# EAGLE design UI PCB (EAGLE 9.5.2)

## Sheet 1 of 6: IO EXP 1
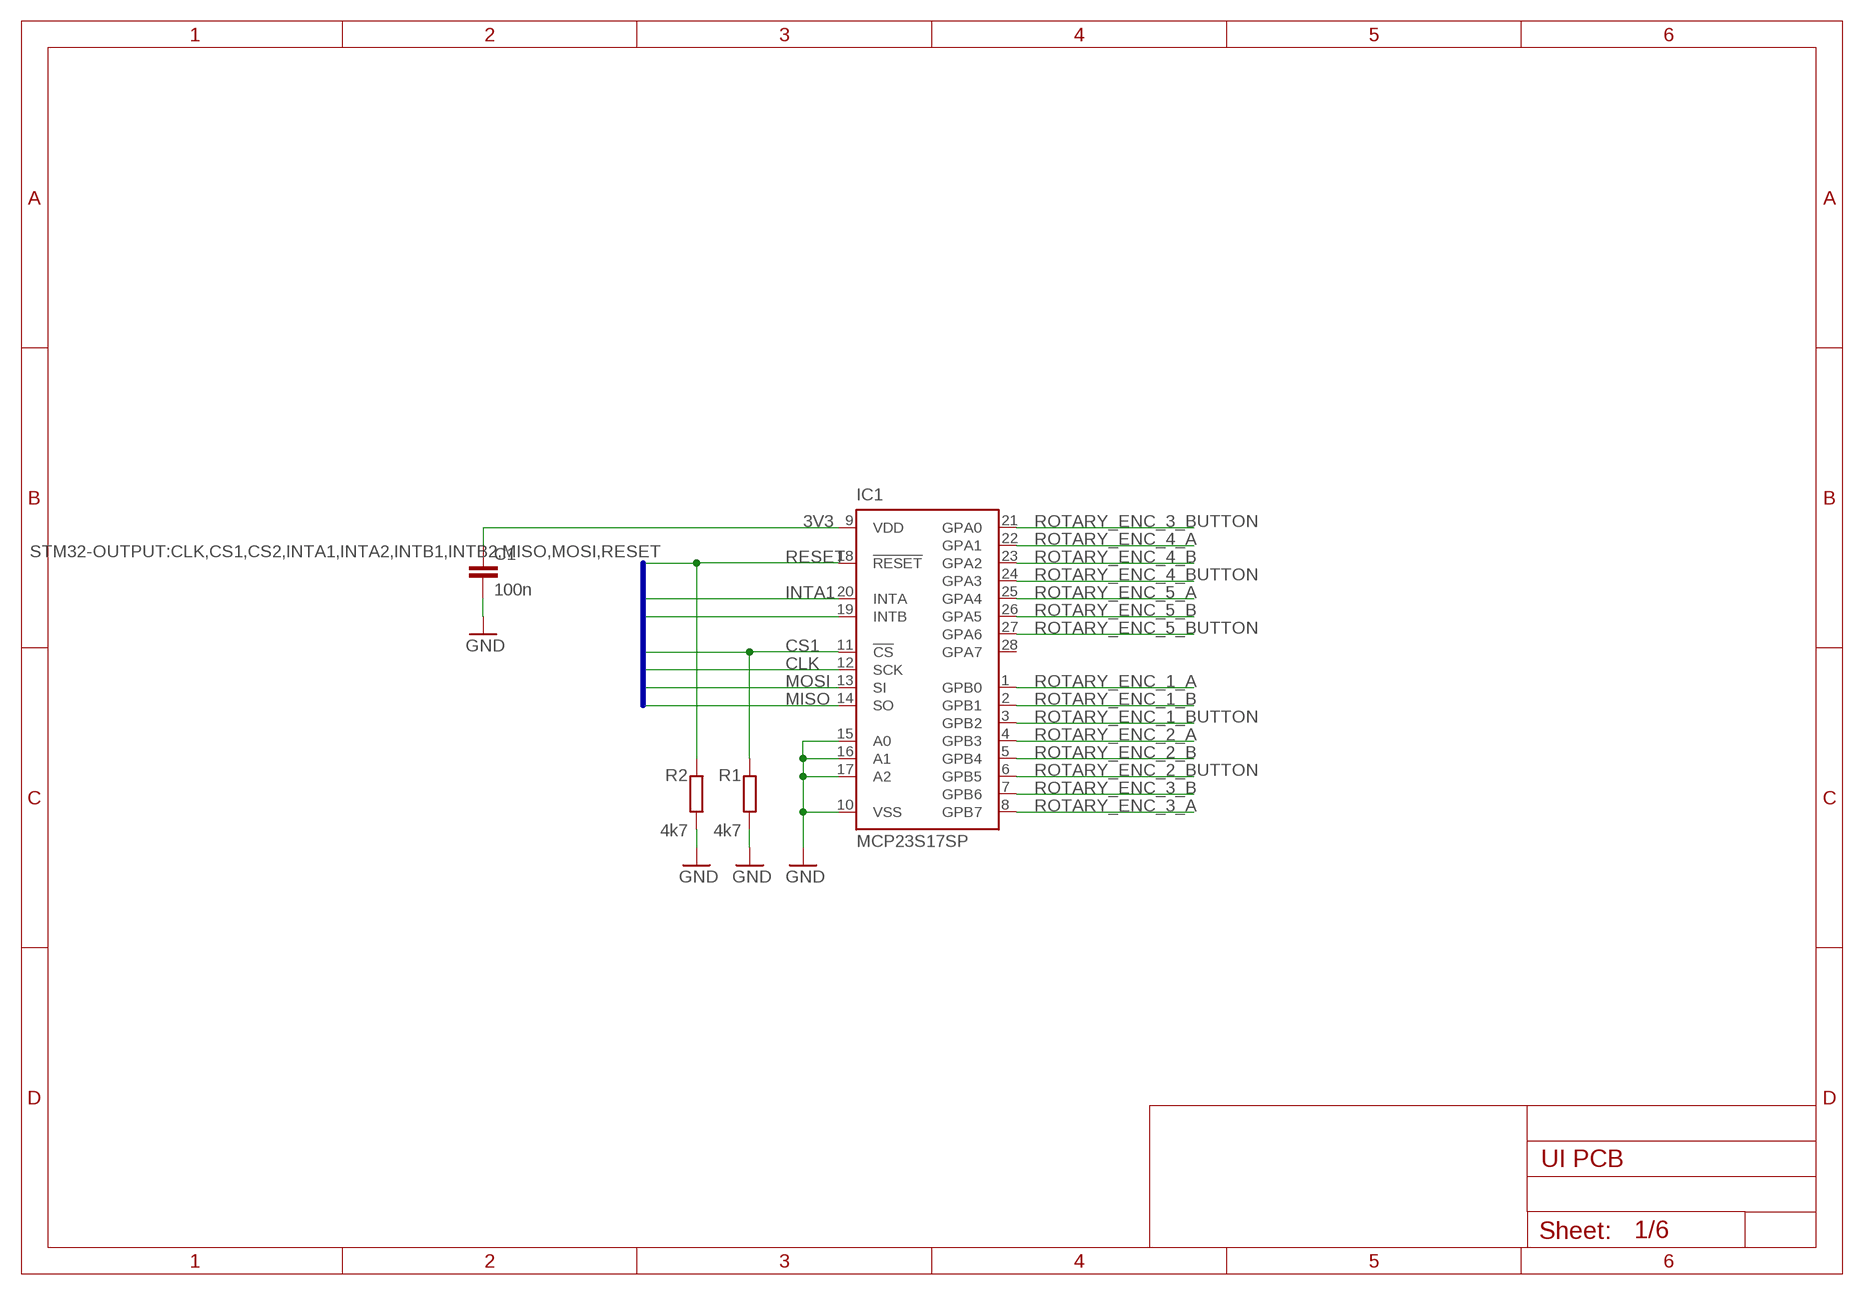
[diagram p0: schematic, sheet 1]

### Parts
C1  100n  C-EUC0603  [C0603]
IC1  MCP23S17SP  [DIL28-3]
R1  4k7  R-EU_R0805  [R0805]
R2  4k7  R-EU_R0805  [R0805]

### Nets
3V3: C1.1 IC1.9(VDD) ; also sheet 2,3,4,5,6
CLK: IC1.12(SCK) ; also sheet 2,5
CS1: IC1.11(!CS) R1.2 ; also sheet 5
GND: C1.2 IC1.10(VSS) IC1.15(A0) IC1.16(A1) IC1.17(A2) R1.1 R2.1 ; also sheet 2,3,4,5,6
INTA1: IC1.20(INTA) ; also sheet 5
INTB1: IC1.19(INTB) ; also sheet 5
MISO: IC1.14(SO) ; also sheet 2,5
MOSI: IC1.13(SI) ; also sheet 2,5
RESET: IC1.18(!RESET) R2.2 ; also sheet 2,5
ROTARY_ENC_1_A: IC1.1(GPB0) ; also sheet 4
ROTARY_ENC_1_B: IC1.2(GPB1) ; also sheet 4
ROTARY_ENC_1_BUTTON: IC1.3(GPB2) ; also sheet 4
ROTARY_ENC_2_A: IC1.4(GPB3) ; also sheet 4
ROTARY_ENC_2_B: IC1.5(GPB4) ; also sheet 4
ROTARY_ENC_2_BUTTON: IC1.6(GPB5) ; also sheet 4
ROTARY_ENC_3_A: IC1.8(GPB7) ; also sheet 4
ROTARY_ENC_3_B: IC1.7(GPB6) ; also sheet 4
ROTARY_ENC_3_BUTTON: IC1.21(GPA0) ; also sheet 4
ROTARY_ENC_4_A: IC1.22(GPA1) ; also sheet 4
ROTARY_ENC_4_B: IC1.23(GPA2) ; also sheet 4
ROTARY_ENC_4_BUTTON: IC1.24(GPA3) ; also sheet 4
ROTARY_ENC_5_A: IC1.25(GPA4) ; also sheet 4
ROTARY_ENC_5_B: IC1.26(GPA5) ; also sheet 4
ROTARY_ENC_5_BUTTON: IC1.27(GPA6) ; also sheet 4
Unconnected: IC1.28(GPA7)

### Buses
STM32-OUTPUT:CLK,CS1,CS2,INTA1,INTA2,INTB1,INTB2,MISO,MOSI,RESET

## Sheet 2 of 6: IO EXP 2
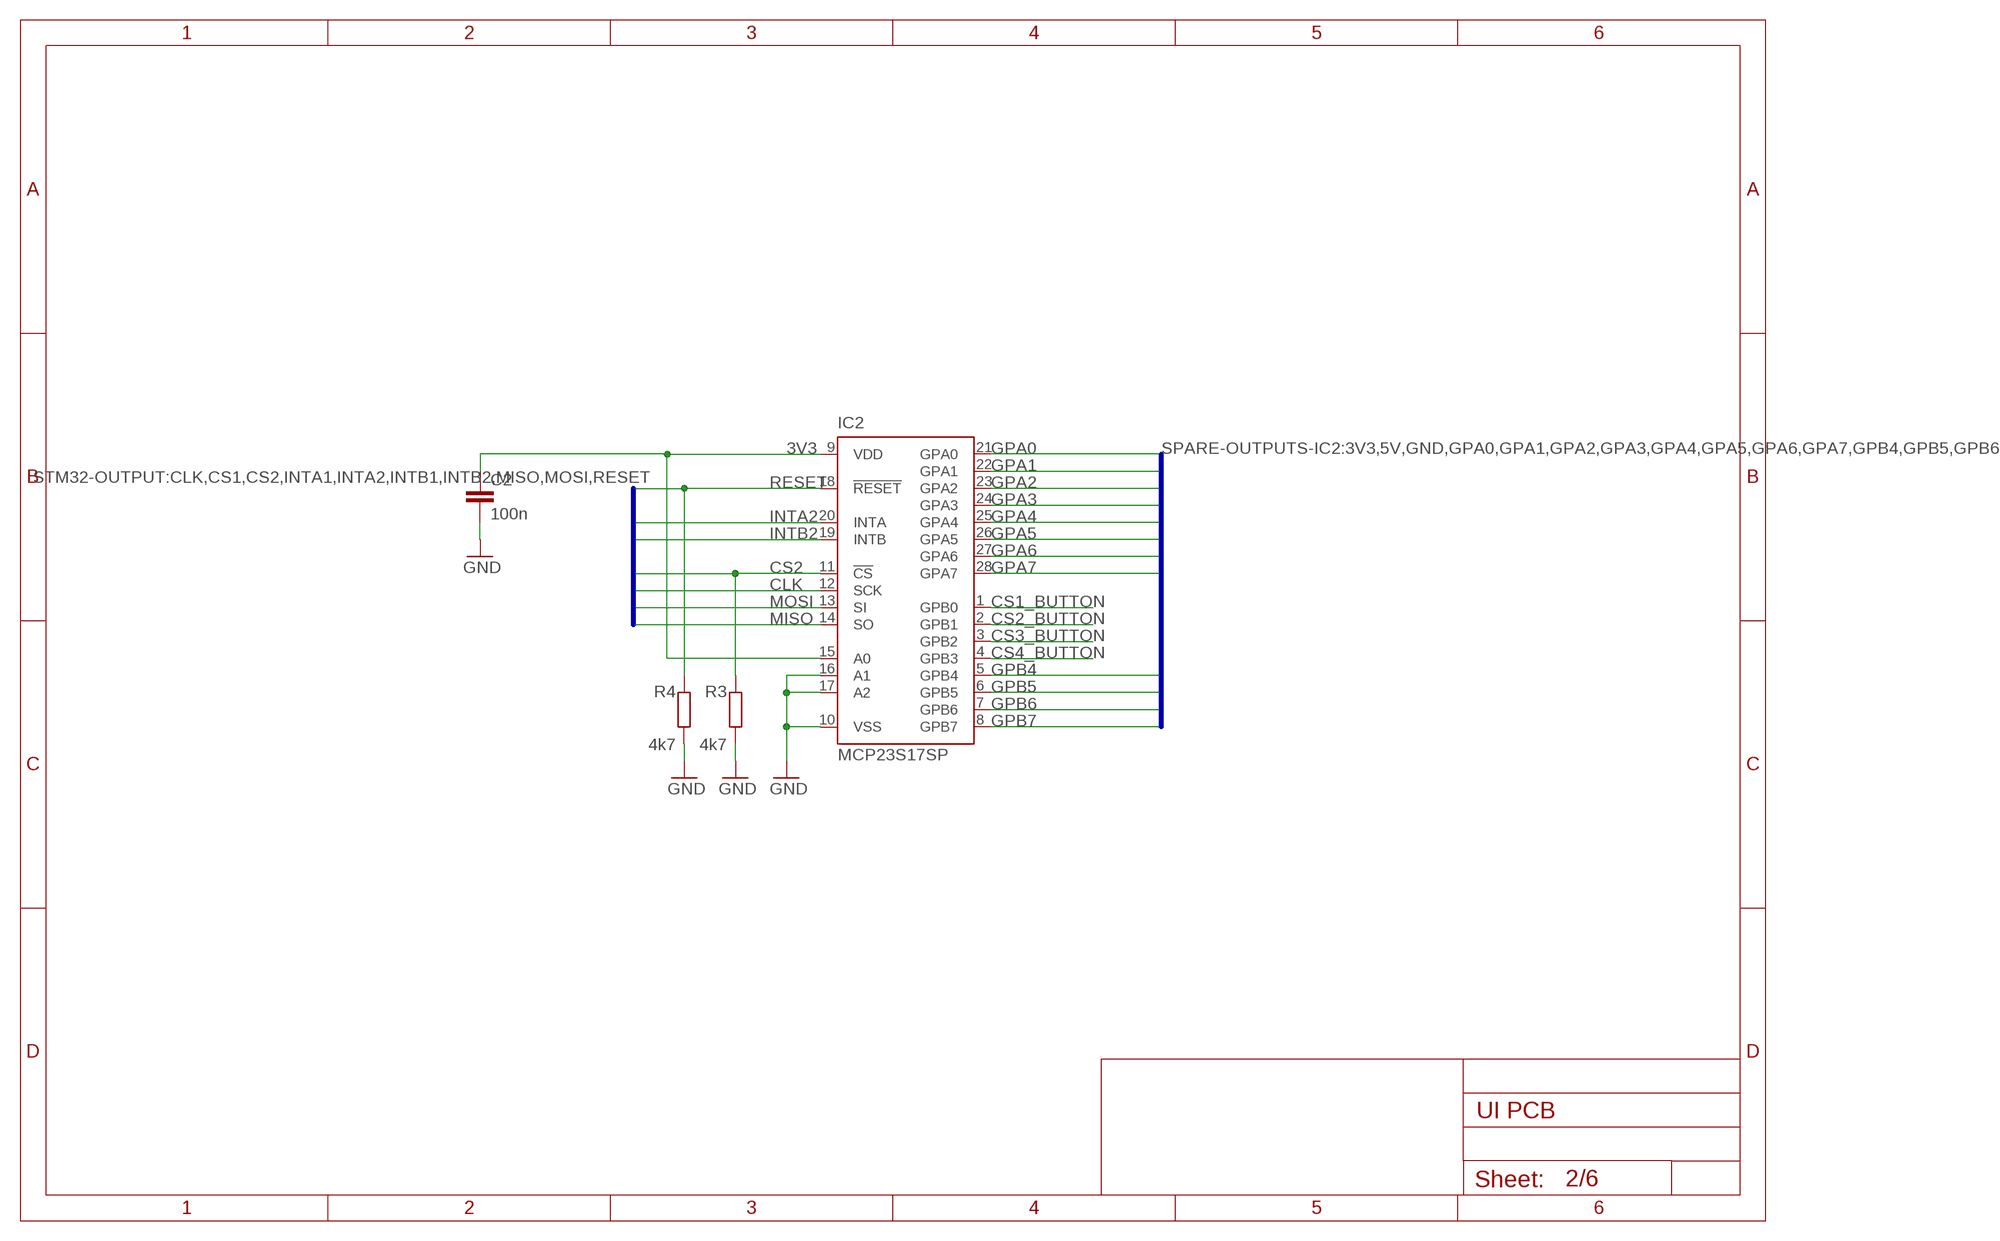
[diagram p1: schematic, sheet 2]

### Parts
C2  100n  C-EUC0603  [C0603]
IC2  MCP23S17SP  [DIL28-3]
R3  4k7  R-EU_R0805  [R0805]
R4  4k7  R-EU_R0805  [R0805]

### Nets
3V3: C2.1 IC2.9(VDD) IC2.15(A0) ; also sheet 1,3,4,5,6
CLK: IC2.12(SCK) ; also sheet 1,5
CS1_BUTTON: IC2.1(GPB0) ; also sheet 3
CS2: IC2.11(!CS) R3.2 ; also sheet 5
CS2_BUTTON: IC2.2(GPB1) ; also sheet 3
CS3_BUTTON: IC2.3(GPB2) ; also sheet 3
CS4_BUTTON: IC2.4(GPB3) ; also sheet 3
GND: C2.2 IC2.10(VSS) IC2.16(A1) IC2.17(A2) R3.1 R4.1 ; also sheet 1,3,4,5,6
GPA0: IC2.21(GPA0) ; also sheet 6
GPA1: IC2.22(GPA1) ; also sheet 6
GPA2: IC2.23(GPA2) ; also sheet 6
GPA3: IC2.24(GPA3) ; also sheet 6
GPA4: IC2.25(GPA4) ; also sheet 6
GPA5: IC2.26(GPA5) ; also sheet 6
GPA6: IC2.27(GPA6) ; also sheet 6
GPA7: IC2.28(GPA7) ; also sheet 6
GPB4: IC2.5(GPB4) ; also sheet 6
GPB5: IC2.6(GPB5) ; also sheet 6
GPB6: IC2.7(GPB6) ; also sheet 6
GPB7: IC2.8(GPB7) ; also sheet 6
INTA2: IC2.20(INTA) ; also sheet 5
INTB2: IC2.19(INTB) ; also sheet 5
MISO: IC2.14(SO) ; also sheet 1,5
MOSI: IC2.13(SI) ; also sheet 1,5
RESET: IC2.18(!RESET) R4.2 ; also sheet 1,5

### Buses
SPARE-OUTPUTS-IC2:3V3,5V,GND,GPA0,GPA1,GPA2,GPA3,GPA4,GPA5,GPA6,GPA7,GPB4,GPB5,GPB6,GPB7
STM32-OUTPUT:CLK,CS1,CS2,INTA1,INTA2,INTB1,INTB2,MISO,MOSI,RESET

## Sheet 3 of 6: CS button cons
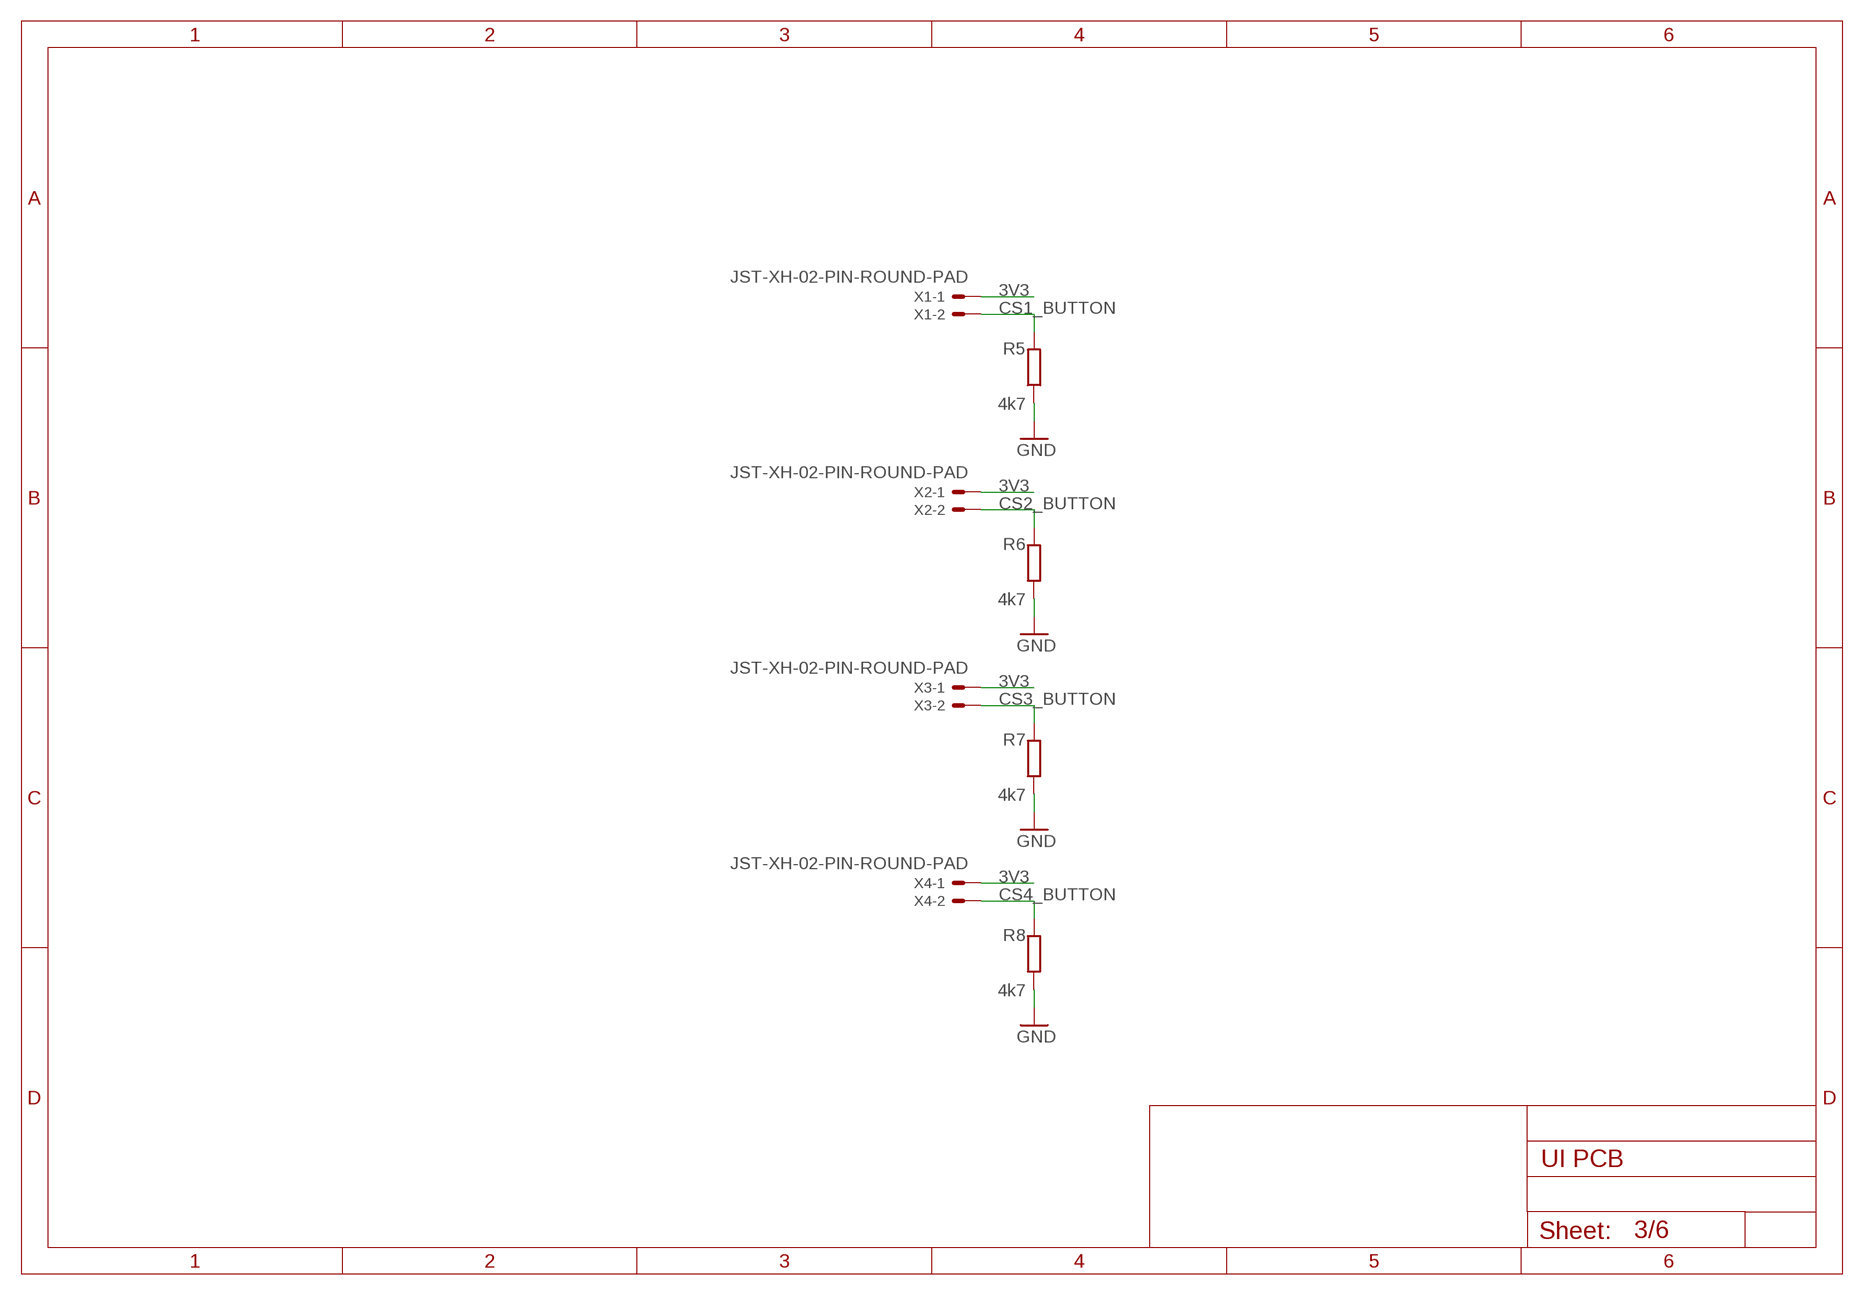
[diagram p2: schematic, sheet 3]

### Parts
R5  4k7  R-EU_R0805  [R0805]
R6  4k7  R-EU_R0805  [R0805]
R7  4k7  R-EU_R0805  [R0805]
R8  4k7  R-EU_R0805  [R0805]
X1  JST-XH-02-PIN-ROUND-PAD  [JST-XH-02-PACKAGE-ROUND-PAD]
X2  JST-XH-02-PIN-ROUND-PAD  [JST-XH-02-PACKAGE-ROUND-PAD]
X3  JST-XH-02-PIN-ROUND-PAD  [JST-XH-02-PACKAGE-ROUND-PAD]
X4  JST-XH-02-PIN-ROUND-PAD  [JST-XH-02-PACKAGE-ROUND-PAD]

### Nets
3V3: X1.1 X2.1 X3.1 X4.1 ; also sheet 1,2,4,5,6
CS1_BUTTON: R5.2 X1.2 ; also sheet 2
CS2_BUTTON: R6.2 X2.2 ; also sheet 2
CS3_BUTTON: R7.2 X3.2 ; also sheet 2
CS4_BUTTON: R8.2 X4.2 ; also sheet 2
GND: R5.1 R6.1 R7.1 R8.1 ; also sheet 1,2,4,5,6

## Sheet 4 of 6: ROT ENC cons
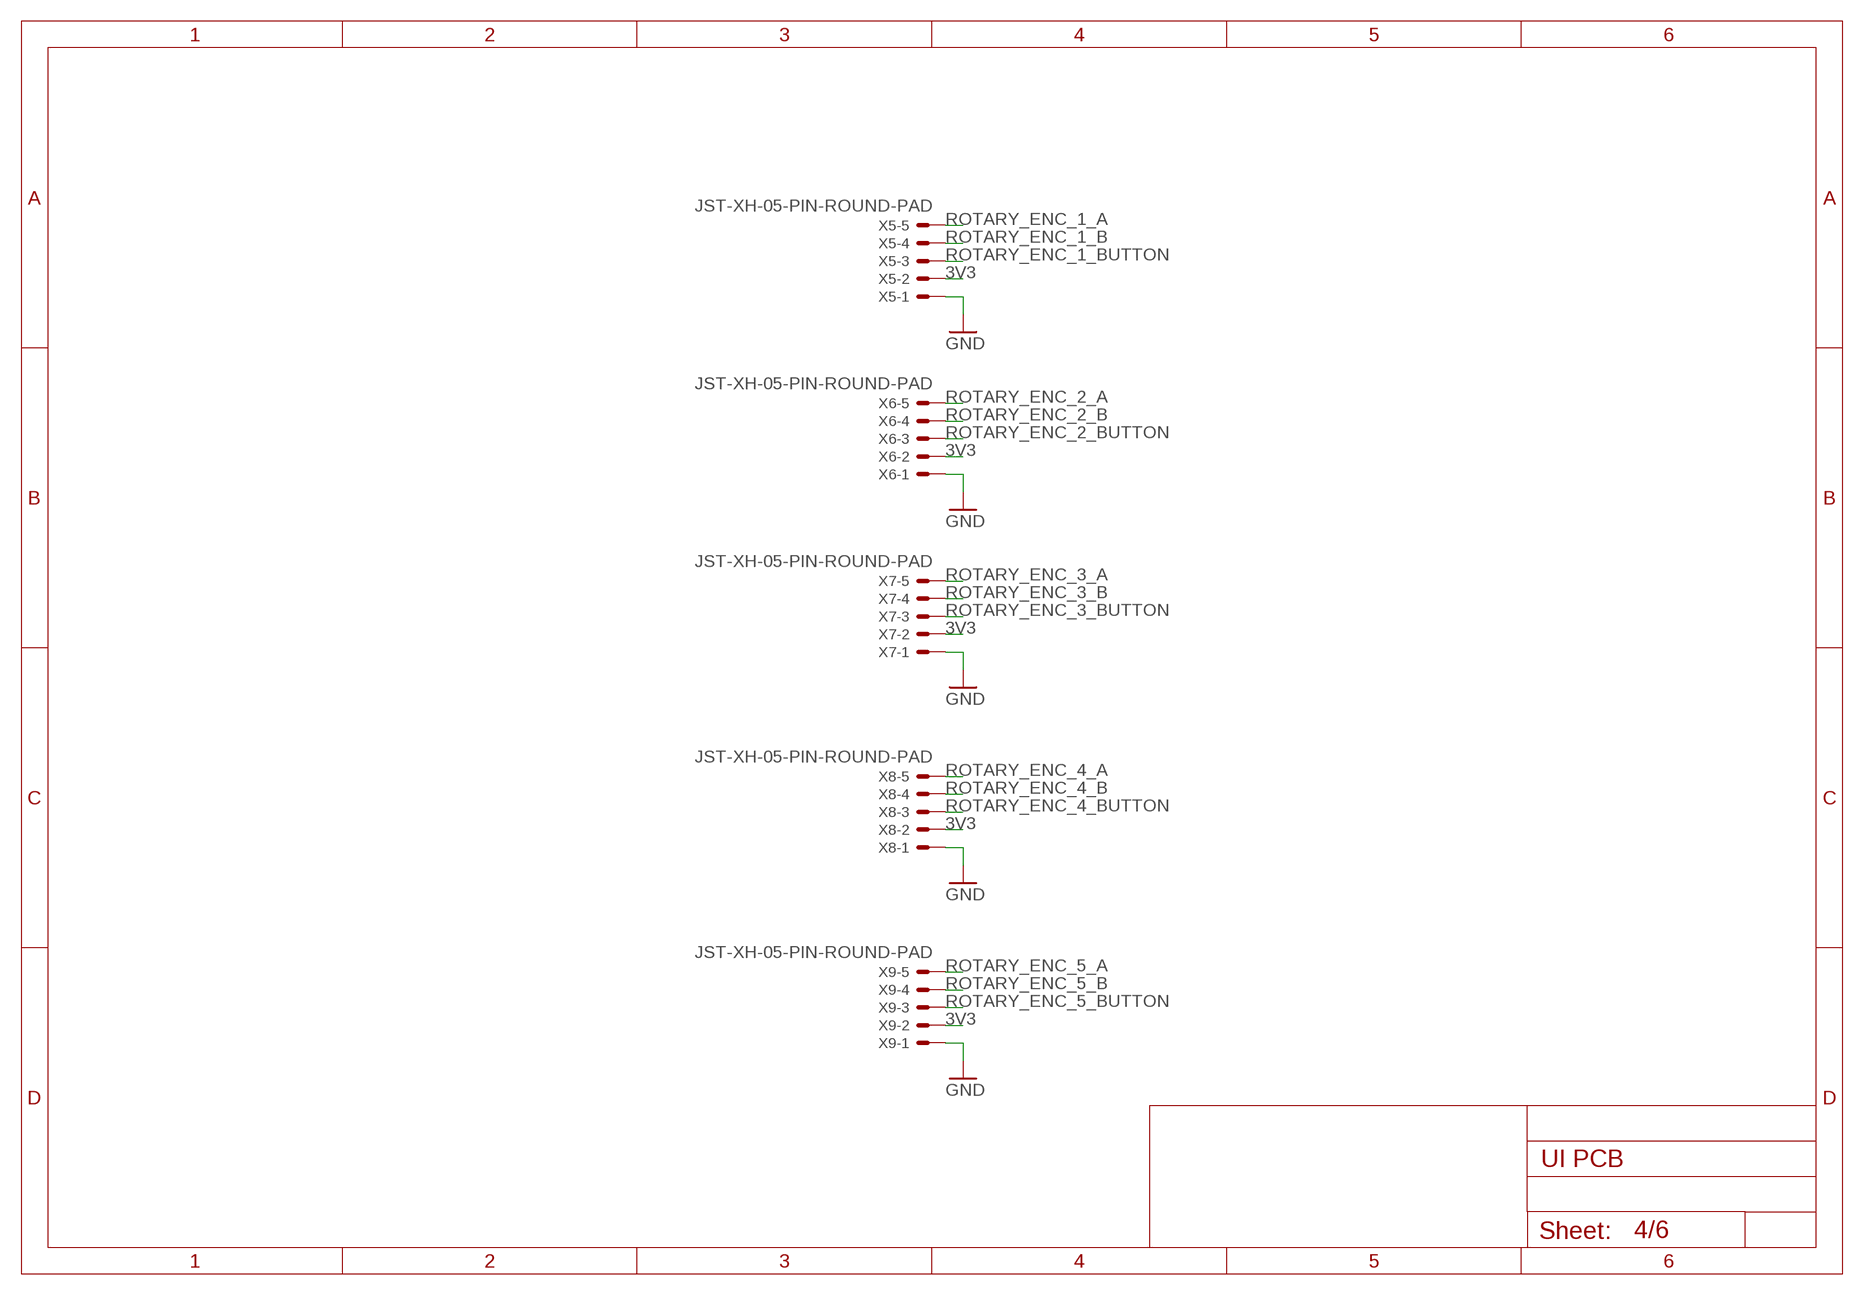
[diagram p3: schematic, sheet 4]

### Parts
X5  JST-XH-05-PIN-ROUND-PAD  [JST-XH-05-PACKAGE-ROUND-PAD]
X6  JST-XH-05-PIN-ROUND-PAD  [JST-XH-05-PACKAGE-ROUND-PAD]
X7  JST-XH-05-PIN-ROUND-PAD  [JST-XH-05-PACKAGE-ROUND-PAD]
X8  JST-XH-05-PIN-ROUND-PAD  [JST-XH-05-PACKAGE-ROUND-PAD]
X9  JST-XH-05-PIN-ROUND-PAD  [JST-XH-05-PACKAGE-ROUND-PAD]

### Nets
3V3: X5.2 X6.2 X7.2 X8.2 X9.2 ; also sheet 1,2,3,5,6
GND: X5.1 X6.1 X7.1 X8.1 X9.1 ; also sheet 1,2,3,5,6
ROTARY_ENC_1_A: X5.5 ; also sheet 1
ROTARY_ENC_1_B: X5.4 ; also sheet 1
ROTARY_ENC_1_BUTTON: X5.3 ; also sheet 1
ROTARY_ENC_2_A: X6.5 ; also sheet 1
ROTARY_ENC_2_B: X6.4 ; also sheet 1
ROTARY_ENC_2_BUTTON: X6.3 ; also sheet 1
ROTARY_ENC_3_A: X7.5 ; also sheet 1
ROTARY_ENC_3_B: X7.4 ; also sheet 1
ROTARY_ENC_3_BUTTON: X7.3 ; also sheet 1
ROTARY_ENC_4_A: X8.5 ; also sheet 1
ROTARY_ENC_4_B: X8.4 ; also sheet 1
ROTARY_ENC_4_BUTTON: X8.3 ; also sheet 1
ROTARY_ENC_5_A: X9.5 ; also sheet 1
ROTARY_ENC_5_B: X9.4 ; also sheet 1
ROTARY_ENC_5_BUTTON: X9.3 ; also sheet 1

## Sheet 5 of 6: STM32 con
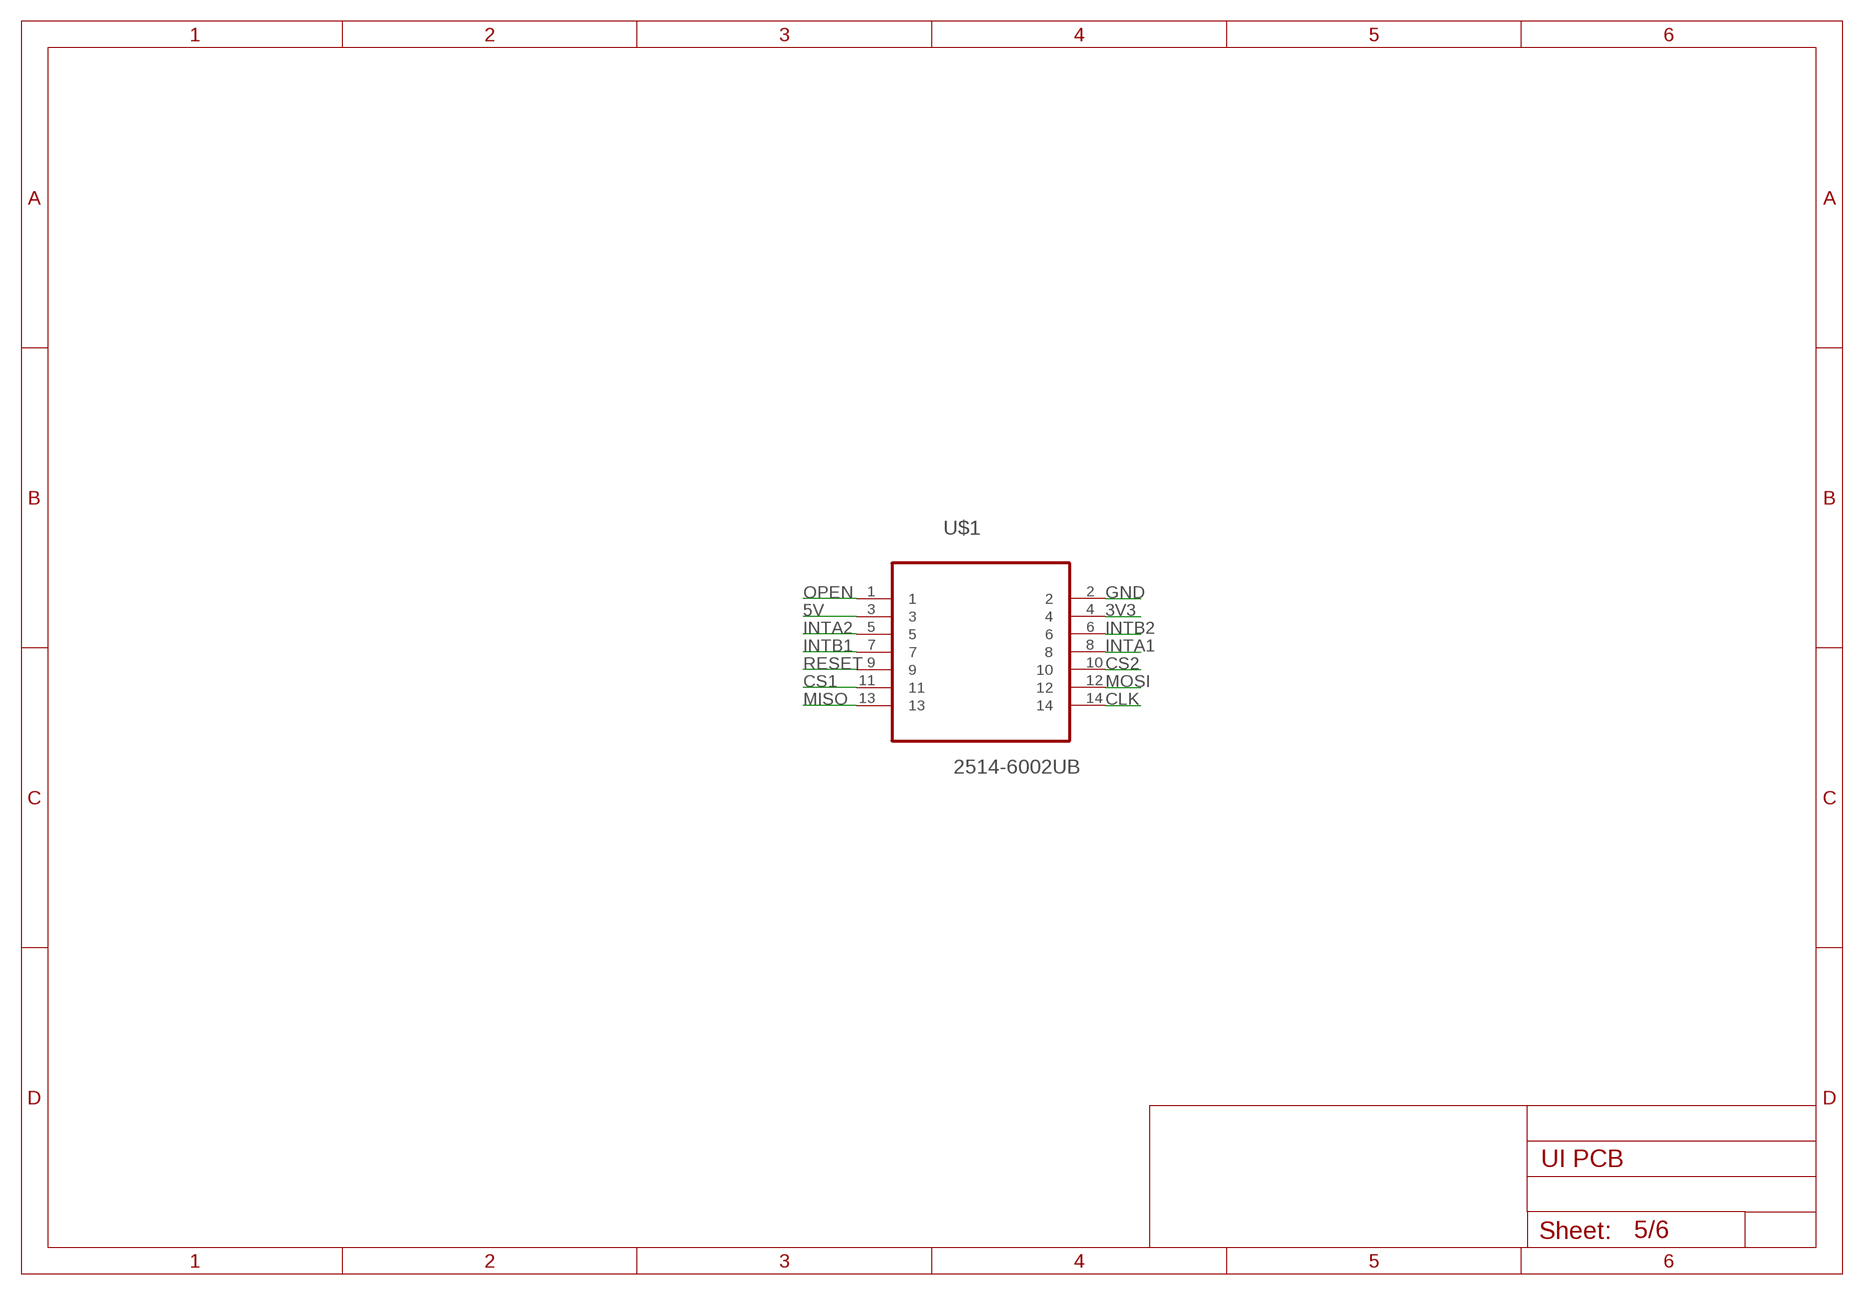
[diagram p4: schematic, sheet 5]

### Parts
U$1  2514-6002UB  [3M_2514-6002UB]

### Nets
3V3: U$1.4 ; also sheet 1,2,3,4,6
5V: U$1.3 ; also sheet 6
CLK: U$1.14 ; also sheet 1,2
CS1: U$1.11 ; also sheet 1
CS2: U$1.10 ; also sheet 2
GND: U$1.2 ; also sheet 1,2,3,4,6
INTA1: U$1.8 ; also sheet 1
INTA2: U$1.5 ; also sheet 2
INTB1: U$1.7 ; also sheet 1
INTB2: U$1.6 ; also sheet 2
MISO: U$1.13 ; also sheet 1,2
MOSI: U$1.12 ; also sheet 1,2
OPEN: U$1.1
RESET: U$1.9 ; also sheet 1,2

## Sheet 6 of 6: SPARE GPIO header
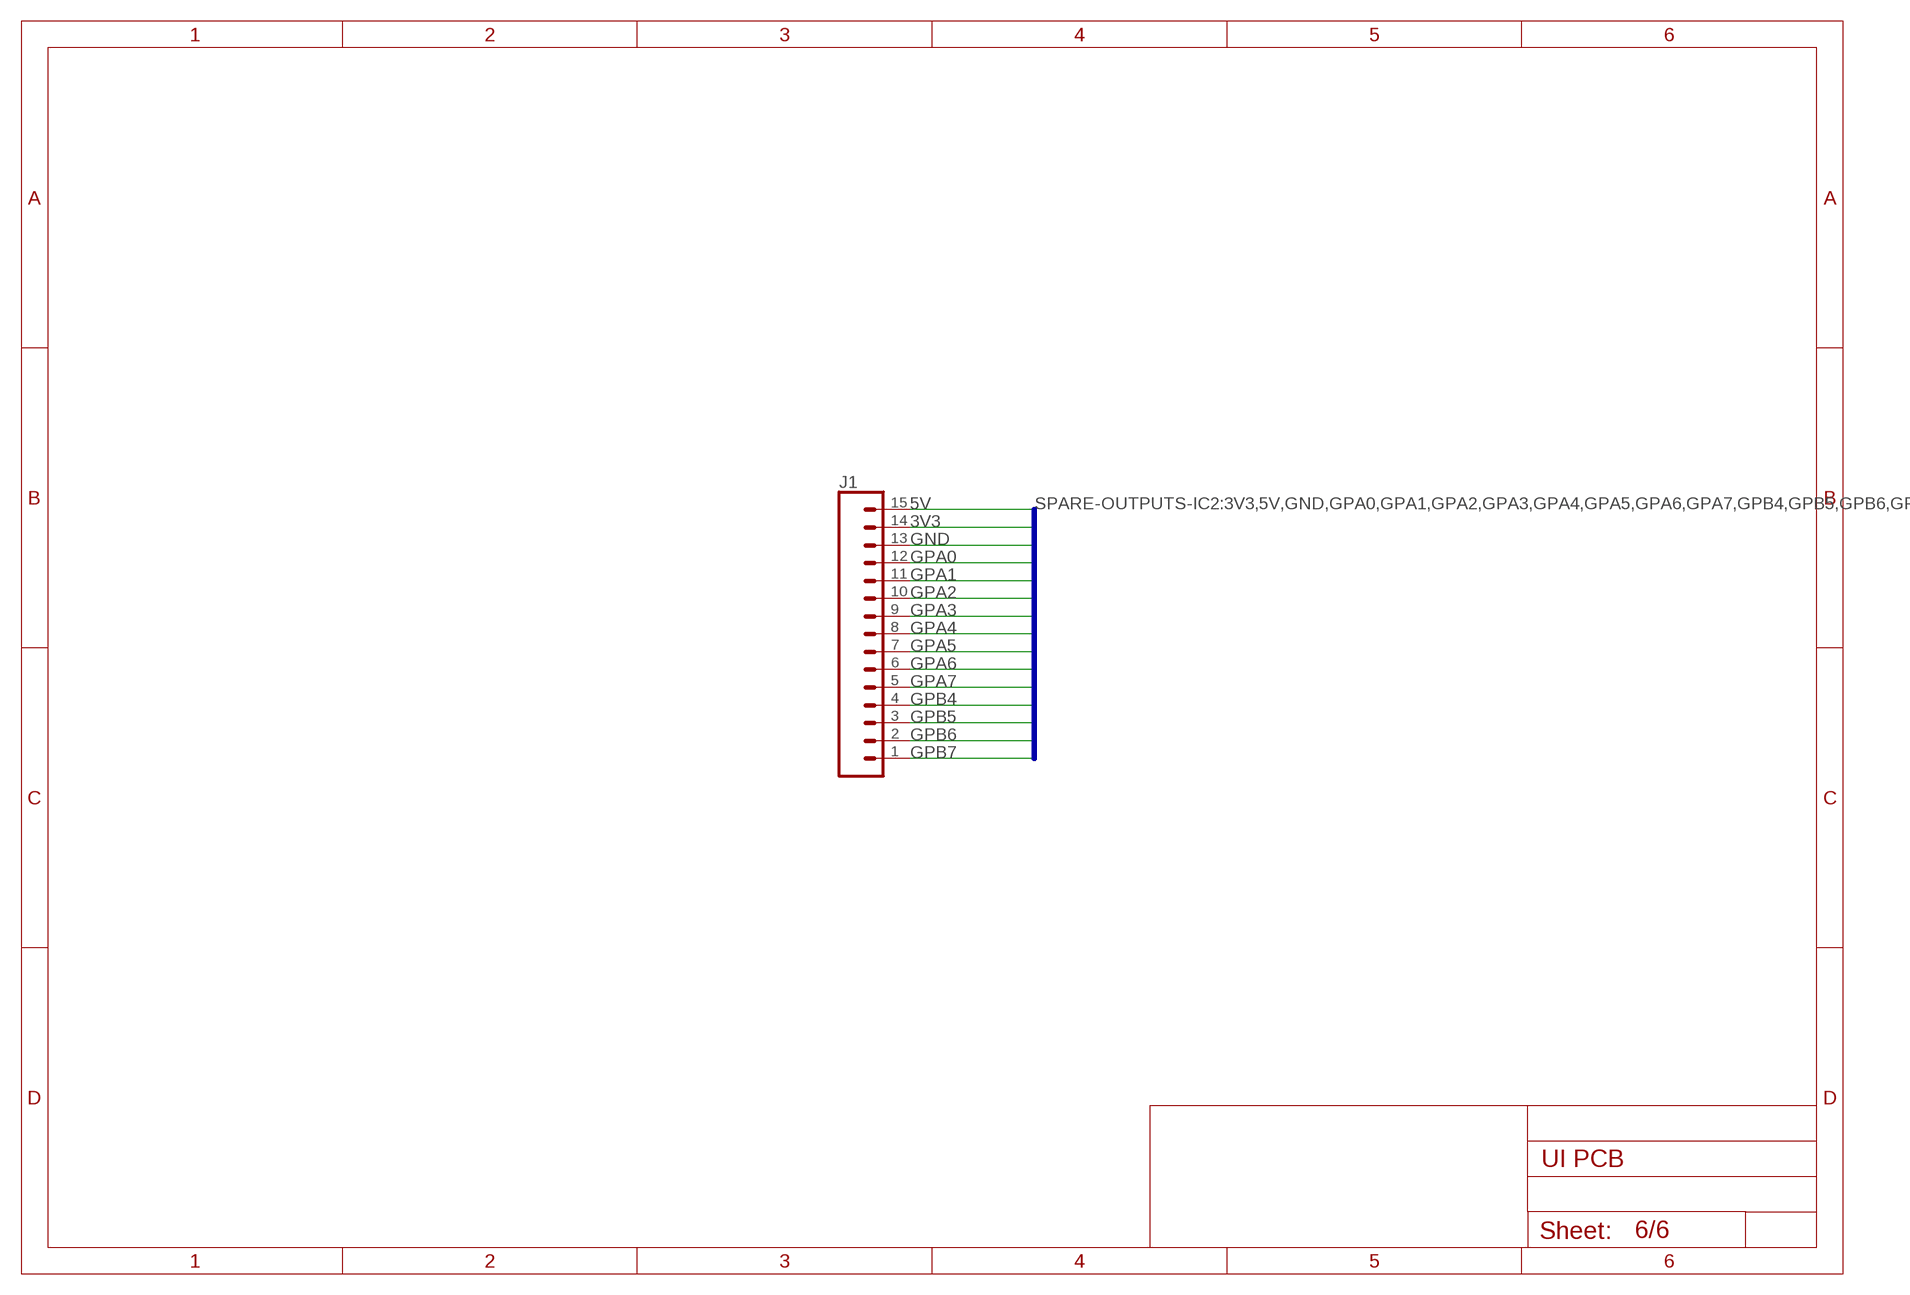
[diagram p5: schematic, sheet 6]

### Parts
J1  CONN_15  [1X15]

### Nets
3V3: J1.14 ; also sheet 1,2,3,4,5
5V: J1.15 ; also sheet 5
GND: J1.13 ; also sheet 1,2,3,4,5
GPA0: J1.12 ; also sheet 2
GPA1: J1.11 ; also sheet 2
GPA2: J1.10 ; also sheet 2
GPA3: J1.9 ; also sheet 2
GPA4: J1.8 ; also sheet 2
GPA5: J1.7 ; also sheet 2
GPA6: J1.6 ; also sheet 2
GPA7: J1.5 ; also sheet 2
GPB4: J1.4 ; also sheet 2
GPB5: J1.3 ; also sheet 2
GPB6: J1.2 ; also sheet 2
GPB7: J1.1 ; also sheet 2

### Buses
SPARE-OUTPUTS-IC2:3V3,5V,GND,GPA0,GPA1,GPA2,GPA3,GPA4,GPA5,GPA6,GPA7,GPB4,GPB5,GPB6,GPB7

## Library data of the parts
C1 C2 = rcl:C-EU: CAPACITOR, European symbol; SPICEPREFIX: C
IC1 IC2 = microchip:MCP23S17: http://ww1.microchip.com/downloads/en/DeviceDoc/21952a.pdf Source: http://ww1.microchip.com/downloads/en/DeviceDoc/21952a.pdf; MF: MICROCHIP; MPN: MCP23S17-E/SP; OC_FARNELL: 1292238; OC_NEWARK: 31K2951
J1 = SparkFun-Connectors:CONN_15: Multi connection point. Often used as Generic Header-pin footprint for 0.1 inch spaced/style header connections On any of the 0.1 inch spaced packages, you can populate with these: Break Away Headers - Straight <https://www.sparkfun.com/products/116> (PRT-00116) Break Away Male Headers - Right Angle <https://www.sparkfun.com/products/553> (PRT-00553) Female Headers <https://www.sparkfun.com/products/115> (PRT-00115) Break Away Headers - Machine Pin <https://www.sparkfun.com/products/117> (PRT-00117) Break Away Female Headers - Swiss Machine Pin <https://www.sparkfun.com/products/743> (PRT-00743) For SCREWTERMINALS and SPRING TERMINALS visit here: Screw Terimnals on SparkFun.com <https://www.sparkfun.com/search/results?term=Screw+Terminals> (5mm/3.5mm/2.54mm spacing) This device is also useful as a general connection point to wire up your design to another part of your project. Our various solder wires solder well into these plated through hole pads. Hook-Up Wire - Assortment (Stranded, 22 AWG) <https://www.sparkfun.com/products/11375> (PRT-11375) Hook-Up Wire - Assortment (Solid Core, 22 AWG) <https://www.sparkfun.com/products/11367> (PRT-11367) View the entire wire category on our website here <https://www.sparkfun.com/categories/141> Special notes: Molex polarized connector foot print use with SKU : PRT-08231 with associated crimp pins and housings. 1MM SMD Version SKU: PRT-10208 NOTES ON THE VARIANTS LOCK and LOCK_LONGPADS... This footprint was designed to help hold the alignment of a through-hole component (i.e. 6-pin header) while soldering it into place. You may notice that each hole has been shifted either up or down by 0.005 of an inch from it's more standard position (which is a perfectly straight line). This slight alteration caused the pins (the squares in the middle) to touch the edges of the holes. Because they are alternating, it causes a "brace" to hold the component in place. 0.005 has proven to be the perfect amount of "off-center" position when using our standard breakaway headers. Although looks a little odd when you look at the bare footprint, once you have a header in there, the alteration is very hard to notice. Also,if you push a header all the way into place, it is covered up entirely on the bottom side.
R1-R8 = rcl:R-EU_: RESISTOR, European symbol; SPICEPREFIX: R
U$1 = 2514-6002UB:2514-6002UB: Four-Wall Header; MPN: 2514-6002UB; OC_FARNELL: 1368928; OC_NEWARK: 46F4726; PACKAGE: Four-Wall Header, 14way; SUPPLIER: 3M
X1-X4 = JST XH Connectors v1-0:JST-XH-02-PIN: JST XH Connector 2 Pin Wire to board connector. Pitch: 2,54 mm, (0.100") Number of pins: 2 Created by Rembrandt Electronics www.rembrandtelectronics.com
X5-X9 = JST XH Connectors v1-0:JST-XH-05-PIN: JST XH Connector 2 Pin Wire to board connector. Pitch: 2,54 mm, (0.100") Number of pins: 5 Created by Rembrandt Electronics www.rembrandtelectronics.com

## Board
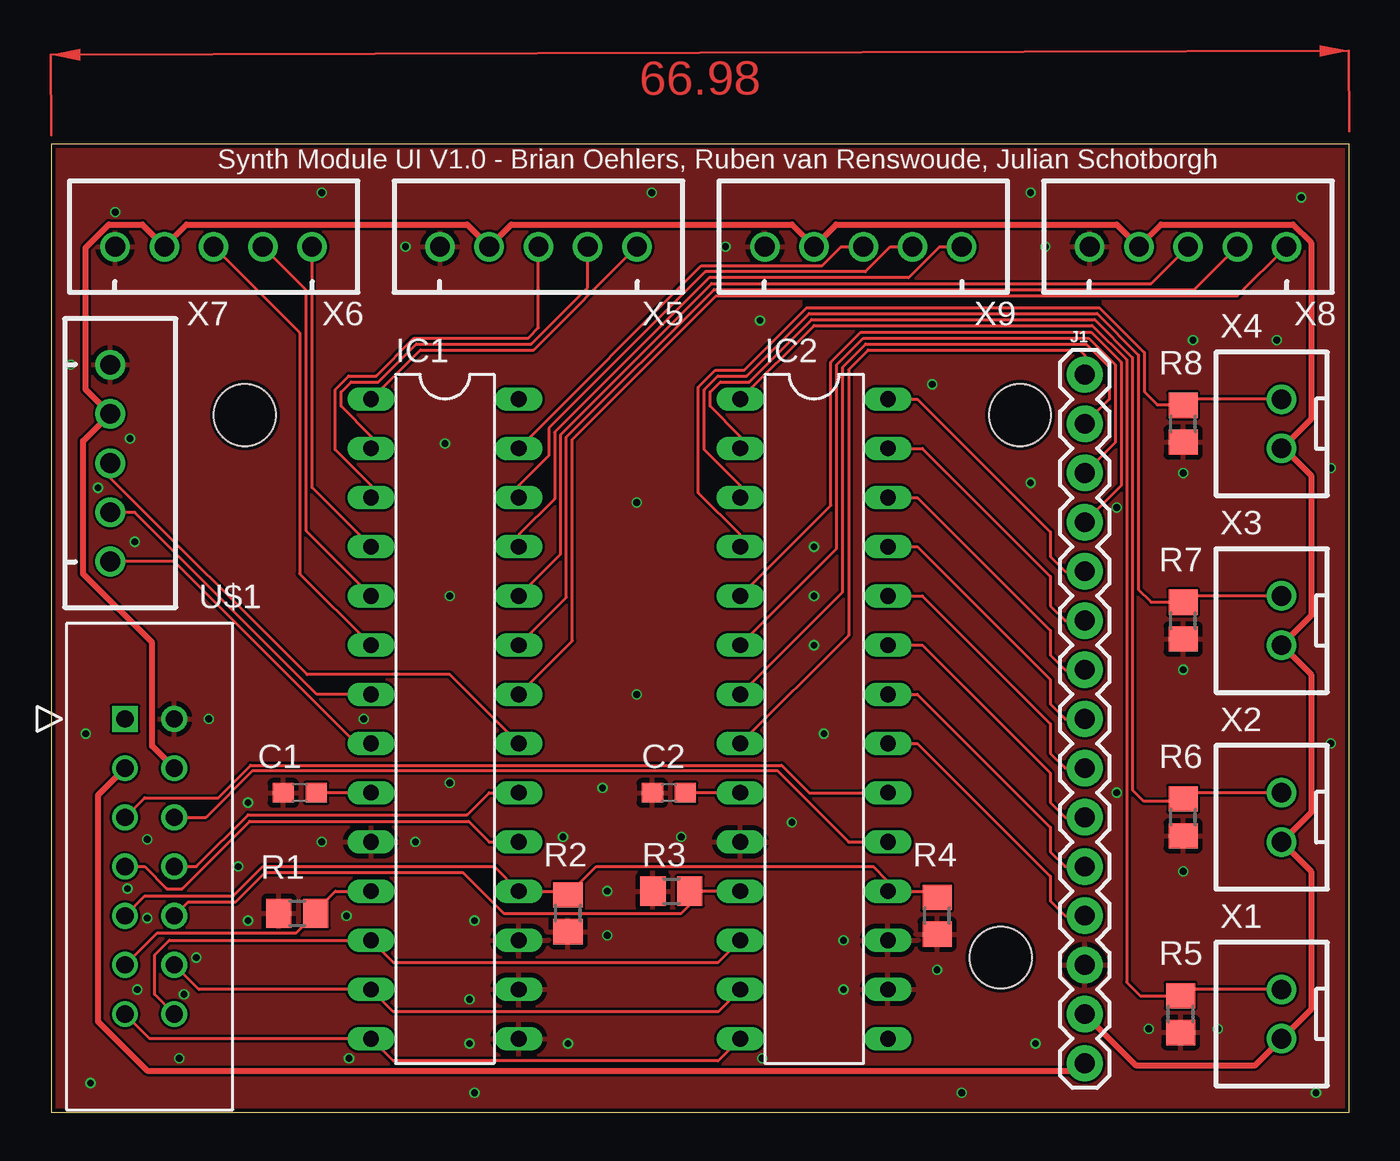
[diagram p6: board, top side]
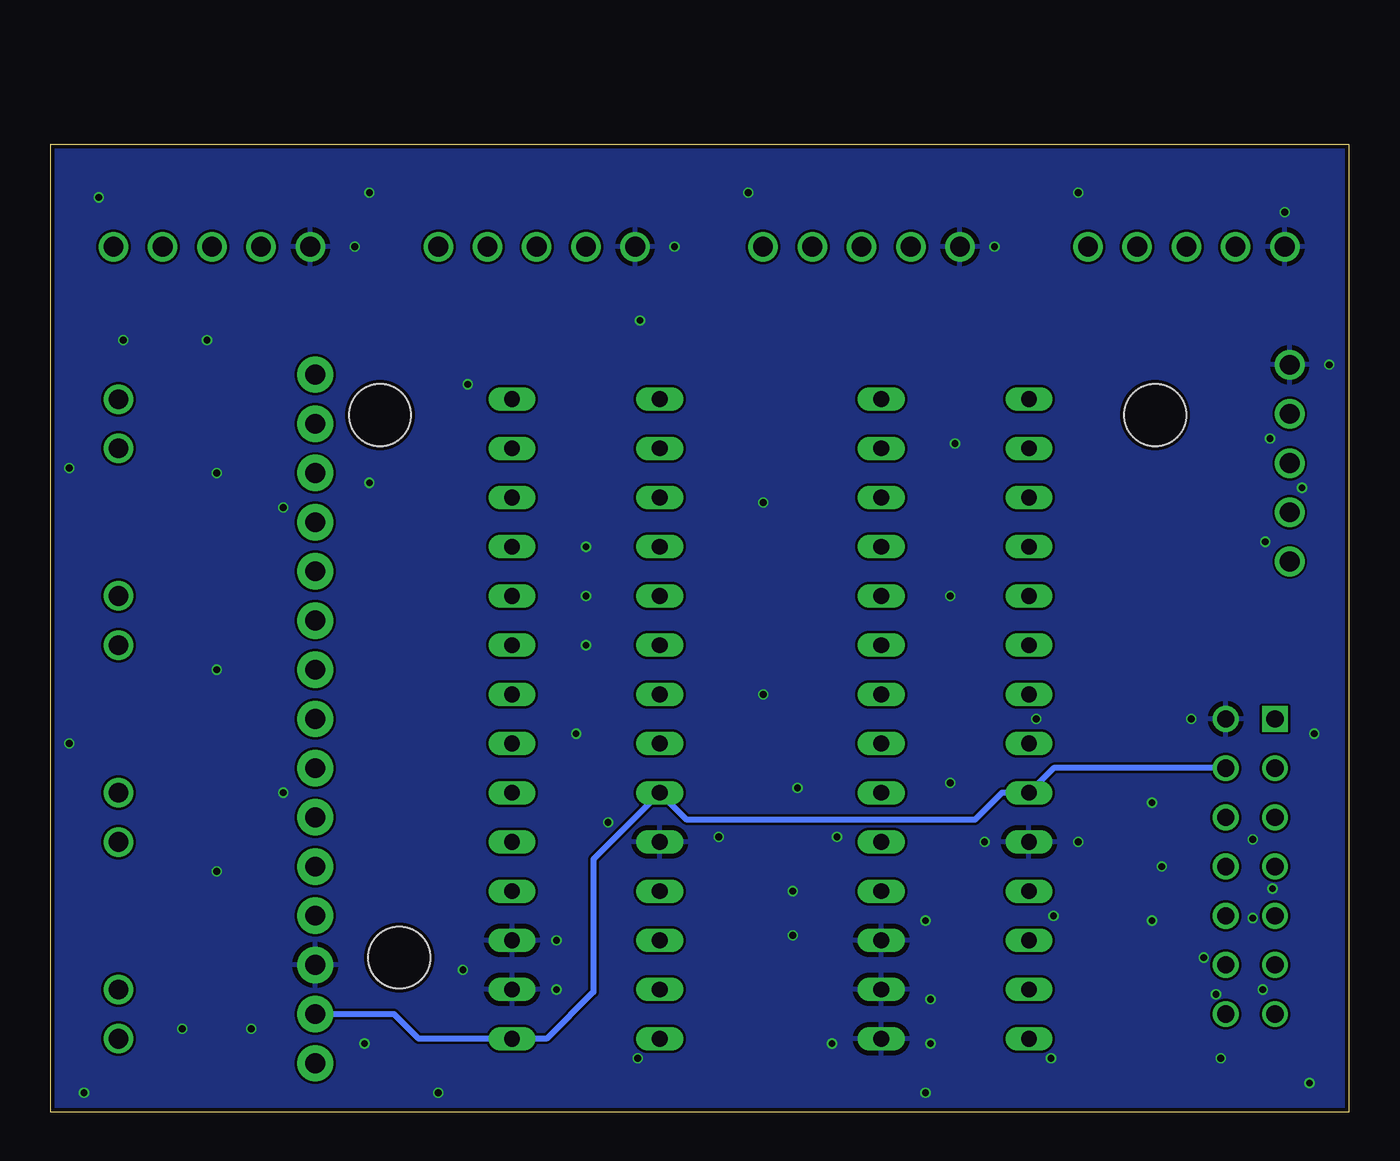
[diagram p7: board, bottom side, seen from below]

Size 67 x 50 mm. Coordinates in mm from the lower left corner, seen from the top.
Outline: 0,0 67,0 67,50 0,50 0,0
Copper layers (1*16): Top 0.035559375mm / dielectric 1.6mm / Bottom 0.035559375mm
Design rules "jlcpcb2layer": minimum track width 5mil, minimum drill 12mil, track to track 5mil, track to pad 5mil, pad to pad 5mil, via to via 5mil, smd to smd 5mil, copper to edge 8mil, drill to drill 6mil, minimum pad ring 5mil, minimum via ring 3mil, stop-mask expansion 2.5mil, vias tented up to drill 0mil, thermal gap 10mil
Holes 3.2 mm at 10,36 50,36 49,8

### Footprints (pad centres in the part's own frame; a part is rotated, then mirrored left to right if it is on the bottom)
C0603 = smd 1.1 x 1: 1 -0.85,0; 2 0.85,0
DIL28-3 = drill 0.813 long: 1 -16.51,-3.81; 2 -13.97,-3.81; 3 -11.43,-3.81; 4 -8.89,-3.81; 5 -6.35,-3.81; 6 -3.81,-3.81; 7 -1.27,-3.81; 8 1.27,-3.81; 9 3.81,-3.81; 10 6.35,-3.81; 11 8.89,-3.81; 12 11.43,-3.81; 13 13.97,-3.81; 14 16.51,-3.81; 15 16.51,3.81; 16 13.97,3.81; 17 11.43,3.81; 18 8.89,3.81; 19 6.35,3.81; 20 3.81,3.81; 21 1.27,3.81; 22 -1.27,3.81; 23 -3.81,3.81; 24 -6.35,3.81; 25 -8.89,3.81; 26 -11.43,3.81; 27 -13.97,3.81; 28 -16.51,3.81
1X15 = drill 1.016 pad 1.88: 1 0,0; 2 2.54,0; 3 5.08,0; 4 7.62,0; 5 10.16,0; 6 12.7,0; 7 15.24,0; 8 17.78,0; 9 20.32,0; 10 22.86,0; 11 25.4,0; 12 27.94,0; 13 30.48,0; 14 33.02,0; 15 35.56,0
R0805 = smd 1.3 x 1.5: 1 -0.95,0; 2 0.95,0
3M_2514-6002UB = drill 0.889 square: 1 0,2.54 | drill 0.889: 2 0,0; 3 -2.54,2.54; 4 -2.54,0; 5 -5.08,2.54; 6 -5.08,0; 7 -7.62,2.54; 8 -7.62,0; 9 -10.16,2.54; 10 -10.16,0; 11 -12.7,2.54; 12 -12.7,0; 13 -15.24,2.54; 14 -15.24,0
JST-XH-02-PACKAGE-ROUND-PAD = drill 1.016: 1 -1.27,0; 2 1.27,0
JST-XH-05-PACKAGE-ROUND-PAD = drill 1.016: 1 -5.08,0; 2 -2.54,0; 3 0,0; 4 2.54,0; 5 5.08,0

### Placement (x,y rotation side)
C1  12.83,16.51 180 top
C2  31.88,16.51 180 top
IC1  20.32,20.32 270 top
IC2  39.37,20.32 270 top
J1  53.34,38.1 270 top
R1  12.7,10.29 0 top
R2  26.67,10.29 90 top
R3  32,11.43 0 top
R4  45.72,10.16 90 top
R5  58.29,5.08 90 top
R6  58.42,15.24 90 top
R7  58.42,25.4 90 top
R8  58.42,35.56 90 top
U$1  6.35,20.32 90 top
X1  63.5,5.08 90 top
X2  63.5,15.24 90 top
X3  63.5,25.4 90 top
X4  63.5,35.56 90 top
X5  25.15,44.7 0 top
X6  8.38,44.7 0 top
X7  3.05,33.53 270 top
X8  58.67,44.7 0 top
X9  41.91,44.7 0 top

### Tracks (layer width: path | path; a pad name or v marks a point on that pad's centre or on a via)
3V3
  Top 0.152: IC2.9 C2.1 | IC1.9 C1.1
  Top 0.305: U$1.4 5.21,18.92 5.21,24.26 1.65,27.81 1.65,34.67 X7.2 1.78,37.34 1.78,44.65 2.97,45.85 4.7,45.85 X6.2 6.99,45.85 21.46,45.85 X5.2 23.75,45.85 38.23,45.85 X9.2 40.51,45.85 54.99,45.85 X8.2 57.28,45.85 64.08,45.85 65.02,44.91 65.02,35.81 X4.1 63.63,34.29 65.02,32.89 65.02,25.65 X3.1 65.02,22.61 65.02,15.49 X2.1 65.02,12.45 65.02,5.33 X1.1 62.1,2.41 56.01,2.41 J1.14
  Bottom 0.305: U$1.4 15.24,17.78 IC1.9 17.91,16.51 19.3,15.11 34.16,15.11 IC2.9 38.99,13.08 38.99,6.22 41.4,3.81 IC2.15 48.01,3.81 49.28,5.08 J1.14
5V
  Top 0.305: U$1.3 2.41,16.38 2.41,4.7 4.95,2.16 52.96,2.16 J1.15
CLK
  Top 0.152: U$1.14 5.33,6.1 5.33,8.13 6.1,8.89 IC1.12 17.65,7.75 34.42,7.75 IC2.12
CS1
  Top 0.152: U$1.11 5.46,9.27 12.63,9.27 R1.2 13.68,10.32 13.68,10.45 14.67,11.43 IC1.11
CS1_BUTTON
  Top 0.152: X1.2 58.61,6.35 R5.2 56.2,6.03 55.5,6.73 55.5,38.86 53.72,40.64 39.37,40.64 IC2.1
CS2
  Top 0.152: IC2.11 R3.2 32.95,10.72 32.52,10.29 23.36,10.29 21.25,12.39 11.05,12.39 9.52,10.87 7.06,10.87 U$1.10
CS2_BUTTON
  Top 0.152: X2.2 58.74,16.51 R6.2 58.29,16.06 56.39,16.06 55.8,16.65 55.8,38.99 53.85,40.95 39.24,40.95 36.02,37.72 34.53,37.72 34.01,37.2 34.01,36.46 35.56,34.91 IC2.2
CS3_BUTTON
  Top 0.152: X3.2 58.74,26.67 R7.2 56.77,26.35 56.11,27.01 56.11,39.12 53.98,41.25 39.12,41.25 35.89,38.02 34.41,38.02 33.71,37.32 33.71,34.23 35.56,32.37 IC2.3
CS4_BUTTON
  Top 0.152: 58.45,36.54 58.74,36.83 X4.2 | 58.45,36.54 R8.2 | IC2.4 35.56,29.83 33.4,31.99 33.4,37.45 34.28,38.33 35.77,38.33 38.99,41.55 54.1,41.55 56.41,39.24 56.41,37.21 57.08,36.54 58.45,36.54
GND  (via drill 0.35)
  other vias: 10.16,16 28.45,16.76 28.7,11.43 58.42,12.45 58.42,33.02 58.42,22.86 51.31,44.7 34.8,44.7 18.29,44.7 10.16,9.91 6.6,2.79 21.59,3.56 26.67,3.56 6.86,6.1 21.59,5.84 9.65,12.7 13.97,13.97 26.42,14.22 32.51,14.22 28.7,9.14 8.13,20.32 1.78,19.56 2.03,1.52 21.84,1.02 1.02,38.61 3.3,46.48 20.32,34.54 20.57,26.67 45.72,7.37 40.89,6.35 40.89,8.89 56.64,4.32 60.2,4.32 46.99,1.02 65.28,1.02 66.04,19.05 66.04,33.27 45.47,37.59 50.55,32.51 54.99,31.24 54.99,16.51 39.37,29.21 39.37,26.67 39.37,24.13 39.88,19.56 38.23,14.99 30.23,21.59 30.23,31.5 58.93,39.88 63.25,39.88 36.58,40.89 13.97,47.5 30.99,47.5 50.55,47.5 64.52,47.24 20.57,17.02 18.8,13.97 15.24,10.16 21.84,9.91 4.32,29.46 2.41,32.26 4.06,34.8 16.13,20.32 4.95,14.1 3.94,11.56 4.95,10.03 7.49,8 4.45,6.35 15.37,2.79 36.7,2.79 50.8,3.56
  pour Top: -0.64,50.8 -0.64,-1 68.31,-1 68.31,50.8
  pour Bottom: -0.64,50.8 -0.64,-1 68.31,-1 68.31,50.8
  cutout Top: 38.86,41.66 38.86,41.91 54.1,41.91 54.1,41.66
GPA0
  Top 0.152: IC2.21 44.7,19.05 51.56,12.19 51.56,10.92 52.32,10.16 J1.12
GPA1
  Top 0.152: IC2.22 44.7,21.59 51.56,14.73 51.56,13.46 52.32,12.7 J1.11
GPA2
  Top 0.152: IC2.23 44.96,24.13 51.56,17.53 51.56,16 52.32,15.24 J1.10
GPA3
  Top 0.152: IC2.24 44.96,26.67 51.56,20.07 51.56,18.54 52.32,17.78 J1.9
GPA4
  Top 0.152: IC2.25 44.7,29.21 51.56,22.35 51.56,21.08 52.32,20.32 J1.8
GPA5
  Top 0.152: IC2.26 44.7,31.75 51.56,24.89 51.56,23.62 52.32,22.86 J1.7
GPA6
  Top 0.152: IC2.27 44.96,34.29 51.56,27.69 51.56,26.16 52.32,25.4 J1.6
GPA7
  Top 0.152: IC2.28 44.7,36.83 51.56,29.97 51.56,28.7 52.32,27.94 J1.5
GPB4
  Top 0.152: IC2.5 40.23,31.34 40.23,38.73 41.78,40.28 53.67,40.28 55.22,38.73 55.22,32.36 J1.4
GPB5
  Top 0.152: IC2.6 40.54,29.11 40.54,38.61 41.91,39.98 53.54,39.98 54.91,38.61 54.91,34.59 J1.3
GPB6
  Top 0.152: IC2.7 40.84,26.87 40.84,38.48 42.04,39.67 53.42,39.67 54.51,38.58 54.61,38.48 54.61,36.83 J1.2
GPB7
  Top 0.152: J1.1 53.34,39.12 53.09,39.37 42.16,39.37 41.15,38.35 41.15,24.64 IC2.8
INTA1
  Top 0.152: U$1.8 7.49,12.7 10.16,15.37 21.46,15.37 22.61,16.51 IC1.20
INTA2
  Top 0.152: U$1.5 4.83,16.26 8.62,16.26 10.3,17.93 37.69,17.93 39.12,16.51 IC2.20
INTB1
  Top 0.152: U$1.7 4.83,12.7 5.97,11.56 6.75,11.56 10.23,15.04 21.54,15.04 22.61,13.97 IC1.19
INTB2
  Top 0.152: U$1.6 8,15.24 10.41,17.65 37.47,17.65 41.15,13.97 IC2.19
MISO
  Top 0.152: IC2.14 34.42,2.67 17.65,2.67 IC1.14 5.08,3.81 U$1.13
MOSI
  Top 0.152: IC2.13 34.42,5.21 17.65,5.21 IC1.13 7.62,6.35 U$1.12
RESET
  Top 0.152: R4.2 45.4,11.43 IC2.18 43.18,11.94 42.42,12.7 28.13,12.7 R2.2 26.48,11.43 IC1.18 22.86,12.7 10.92,12.7 9.4,11.18 4.83,11.18 U$1.9
ROTARY_ENC_1_A
  Top 0.152: IC1.1 19.05,39.37 24.89,39.37 X5.5
ROTARY_ENC_1_B
  Top 0.152: IC1.2 16.51,34.91 14.96,36.46 14.96,37.2 15.48,37.72 16.89,37.72 18.85,39.67 24.77,39.67 27.69,42.6 X5.4
ROTARY_ENC_1_BUTTON
  Top 0.152: IC1.3 16.51,32.37 14.66,34.23 14.66,37.32 15.36,38.02 16.77,38.02 18.72,39.98 24.61,39.98 25.15,40.51 X5.3
ROTARY_ENC_2_A
  Top 0.152: IC1.4 13.46,32.26 X6.5
ROTARY_ENC_2_B
  Top 0.152: IC1.5 13.16,30.02 13.16,42.47 X6.4
ROTARY_ENC_2_BUTTON
  Top 0.152: IC1.6 12.83,27.81 12.83,40.26 X6.3
ROTARY_ENC_3_A
  Top 0.152: IC1.8 15.75,19.05 6.35,28.45 X7.5
ROTARY_ENC_3_B
  Top 0.152: IC1.7 13.72,21.59 4.32,30.99 X7.4
ROTARY_ENC_3_BUTTON
  Top 0.152: IC1.21 20.57,22.61 13.21,22.61 3.05,32.77 X7.3
ROTARY_ENC_4_A
  Top 0.152: IC1.22 26.9,24.36 26.9,34.75 34.31,42.16 61.21,42.16 X8.5
ROTARY_ENC_4_B
  Top 0.152: IC1.23 26.59,26.59 26.59,34.88 34.21,42.49 59,42.49 X8.4
ROTARY_ENC_4_BUTTON
  Top 0.152: IC1.24 26.29,28.83 26.29,35 34.09,42.8 56.77,42.8 X8.3
ROTARY_ENC_5_A
  Top 0.152: X9.5 45.85,44.7 44.25,43.1 33.96,43.1 25.98,35.13 25.98,31.69 24.13,29.83 IC1.25
ROTARY_ENC_5_B
  Top 0.152: X9.4 43.31,44.7 42.02,43.41 33.76,43.41 25.68,35.33 25.68,33.92 24.13,32.37 IC1.26
ROTARY_ENC_5_BUTTON
  Top 0.152: X9.3 40.77,44.7 39.78,43.71 33.55,43.71 IC1.27
(copper drawn outside any net)
  shapes: Top area x1

### Text on the board
tNames: Synth Module UI V1.0 - Brian Oehlers, Ruben van Renswoude, Julian Schotborgh